# Altium schematic sheet RIGHT_AR0234.SchDoc: =project_title
size Tabloid; CompanyName: Luxonis Holding; Organization: Luxonis Holding; Address1: 1925 Harmony Park Drive; Address2: Westminster, CO; Address3: 80234; Address4: United States; SheetNumber: 10; SheetTotal: 11
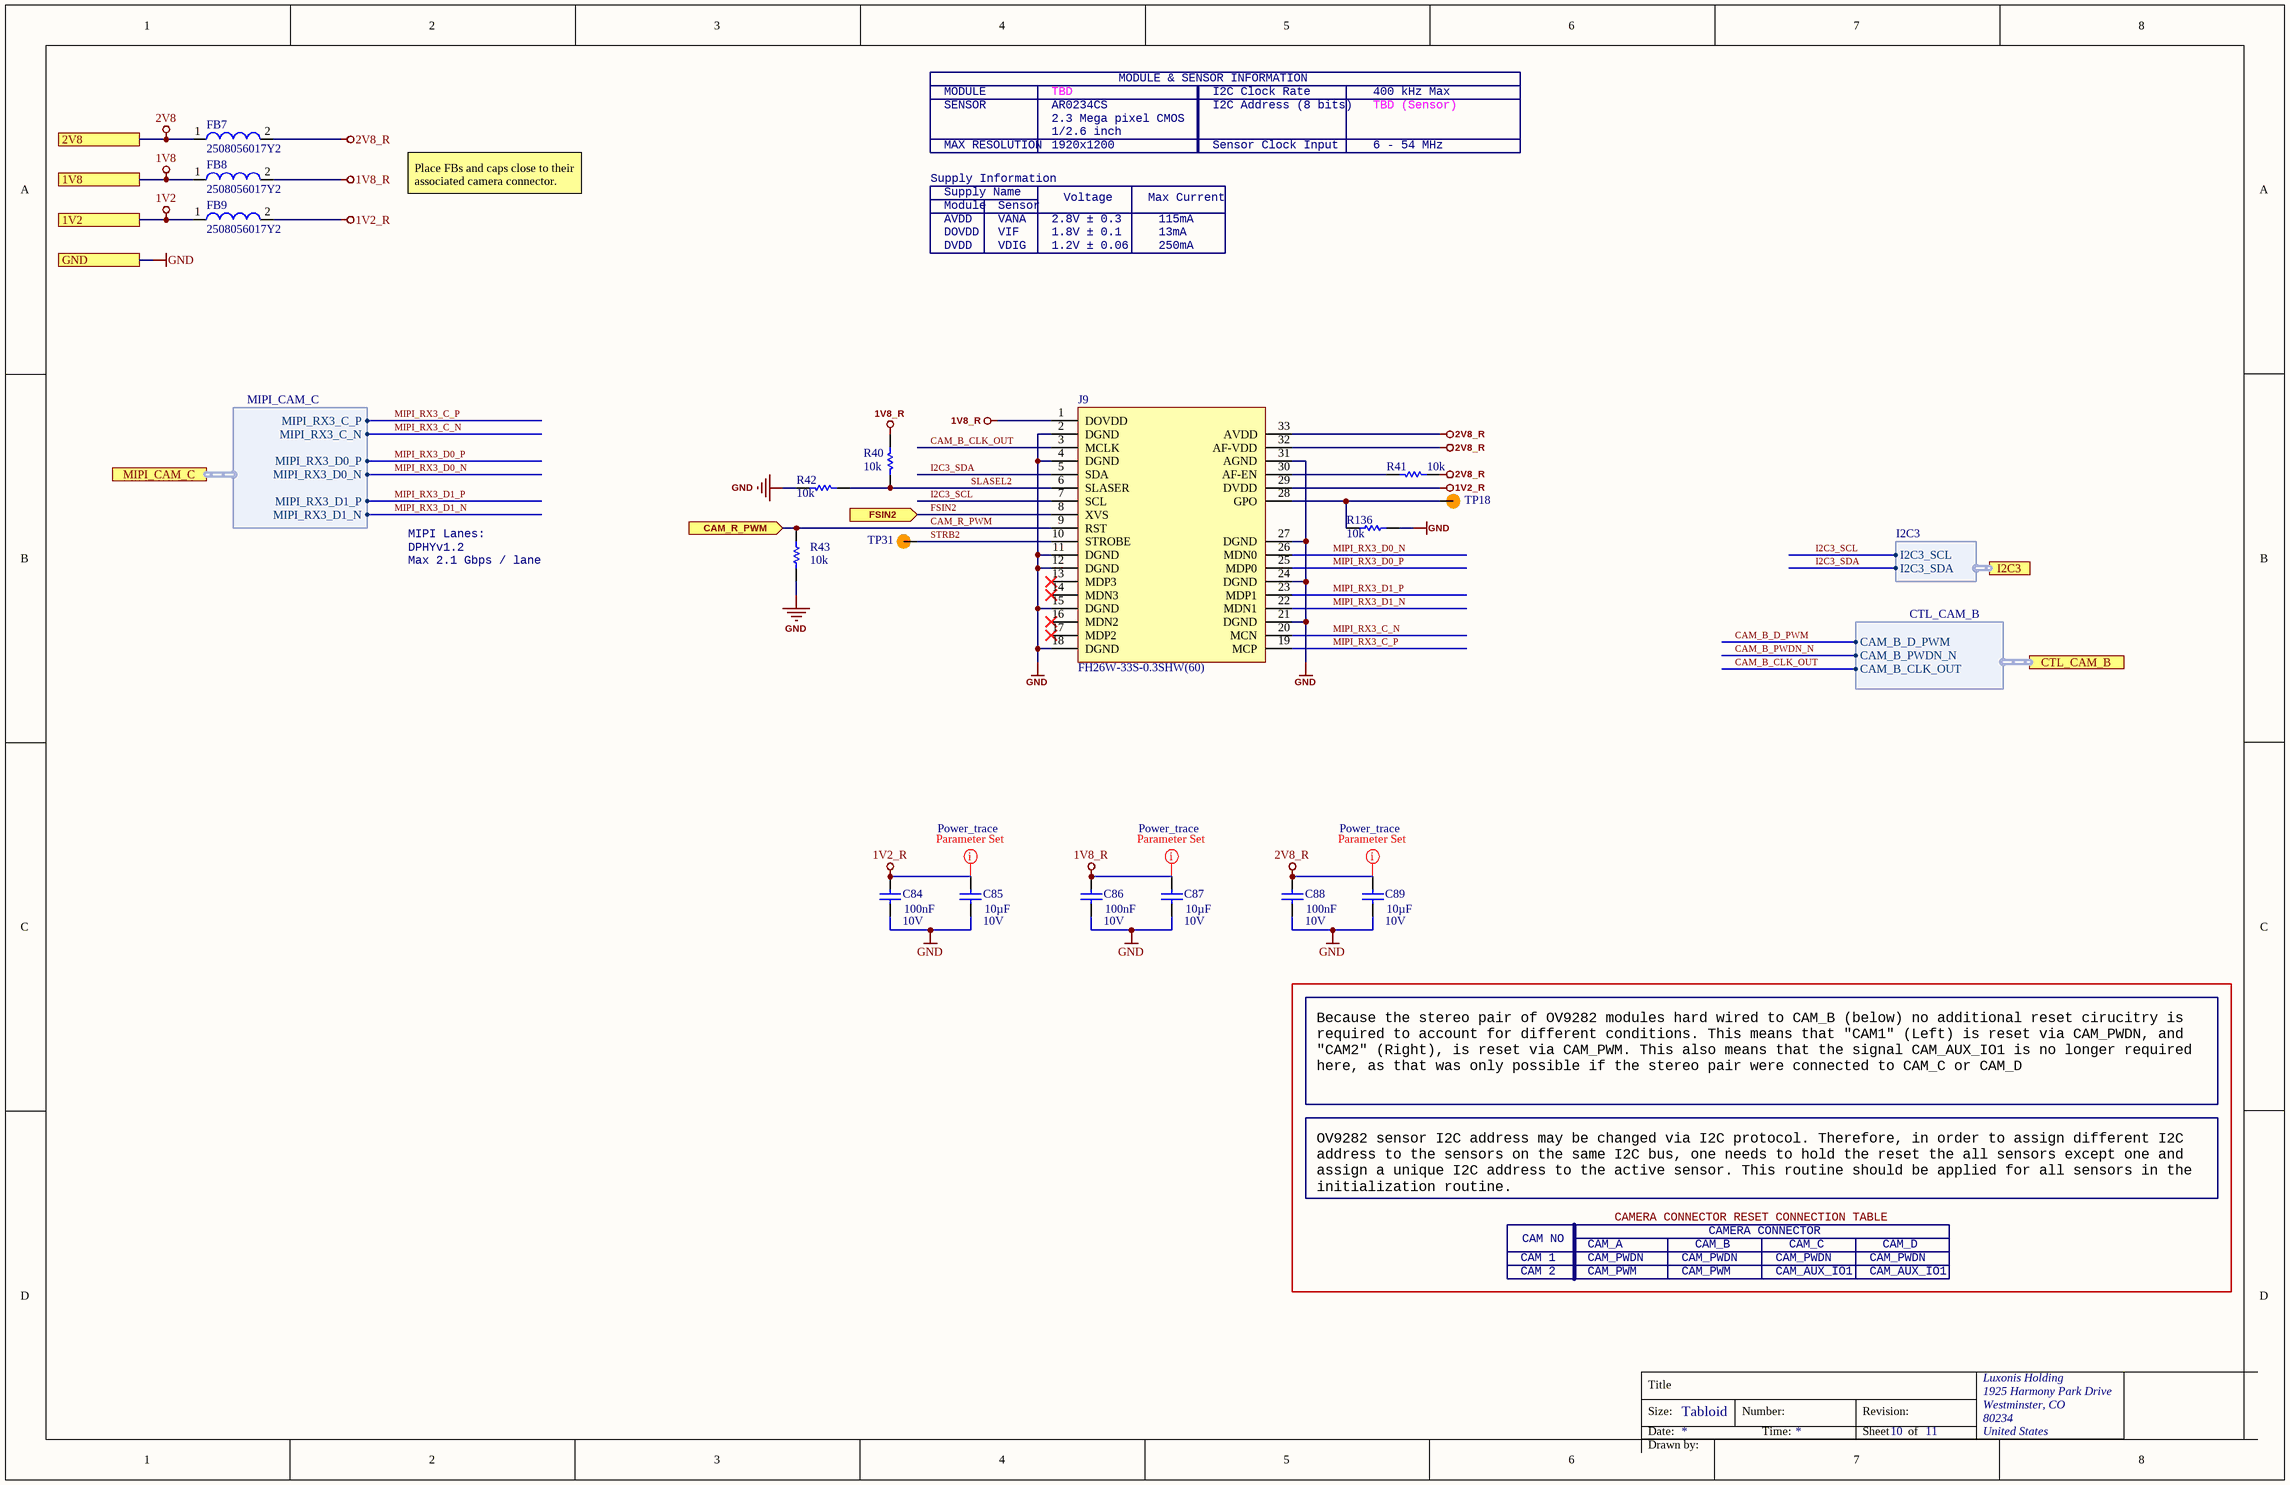
[diagram p0: RIGHT_AR0234.SchDoc]

## Parts
C84  value 100nF  Voltage Rating: 10V  [CAPC0402(1005)70_L]  (hidden comment: GRM155R71A104JA01D)
C85  value 10µF  Voltage Rating: 10V  [CAPC0603(1608)100_L]  (hidden comment: GRM188R61A106ME69D)
C86  value 100nF  Voltage Rating: 10V  [CAPC0402(1005)70_L]  (hidden comment: GRM155R71A104JA01D)
C87  value 10µF  Voltage Rating: 10V  [CAPC0603(1608)100_L]  (hidden comment: GRM188R61A106ME69D)
C88  value 100nF  Voltage Rating: 10V  [CAPC0402(1005)70_L]  (hidden comment: GRM155R71A104JA01D)
C89  value 10µF  Voltage Rating: 10V  [CAPC0603(1608)100_L]  (hidden comment: GRM188R61A106ME69D)
FB7  2508056017Y2  [2508056017Y2]
FB8  2508056017Y2  [2508056017Y2]
FB9  2508056017Y2  [2508056017Y2]
J9  FH26W-33S-0.3SHW(60)  [FH26W-33S-0.3SHW(60)]
R40  value 10k  [RESC0402(1005)_L]  (hidden comment: RC0402FR-1310KL)
R41  value 10k  [RESC0402(1005)_L]  (hidden comment: RC0402FR-1310KL)
R42  value 10k  [RESC0402(1005)_L]  (hidden comment: RC0402FR-1310KL)
R43  value 10k  [RESC0402(1005)_L]  (hidden comment: RC0402FR-1310KL)
R136  value 10k  [RESC0402(1005)_L]  (hidden comment: RC0402FR-1310KL)
TP18  TEST_POINT  [TP100_200_NS]  (value not drawn)  (no BOM)
TP31  TEST_POINT  [TP100_200_NS]  (value not drawn)  (no BOM)

## Ports
1V2, 1V8, 2V8, CAM_R_PWM (in), CTL_CAM_B (harness CTL_CAM_B), FSIN2 (in), GND, I2C3 (harness I2C3), MIPI_CAM_C (harness MIPI_CAM_C)

## Harnesses
MIPI_CAM_C: MIPI_RX3_C_P, MIPI_RX3_C_N, MIPI_RX3_D0_P, MIPI_RX3_D0_N, MIPI_RX3_D1_P, MIPI_RX3_D1_N
I2C3: I2C3_SDA, I2C3_SCL
CTL_CAM_B: CAM_B_CLK_OUT, CAM_B_PWDN_N, CAM_B_D_PWM

## Nets
1V2: FB9.1 ; port 1V2
1V2_R: C84.2 C85.2 FB9.2 J9.29(DVDD)
1V8: FB8.1 ; port 1V8
1V8_R: C86.2 C87.2 FB8.2 J9.1(DOVDD) R40.1
2V8: FB7.1 ; port 2V8
2V8_R: C88.2 C89.2 FB7.2 J9.32(AF-VDD) J9.33(AVDD) R41.2
GND: C84.1 C85.1 C86.1 C87.1 C88.1 C89.1 J9.2(DGND) J9.4(DGND) J9.11(DGND) J9.12(DGND) J9.15(DGND) J9.18(DGND) J9.21(DGND) J9.24(DGND) J9.27(DGND) J9.31(AGND) R42.1 R43.1 R136.2 ; port GND
CAM_B_CLK_OUT: J9.3(MCLK) ; port CTL_CAM_B.CAM_B_CLK_OUT
CAM_B_D_PWM: port CTL_CAM_B.CAM_B_D_PWM
CAM_B_PWDN_N: port CTL_CAM_B.CAM_B_PWDN_N
CAM_R_PWM: J9.9(RST) R43.2 ; port CAM_R_PWM
FSIN2: J9.8(XVS) ; port FSIN2
I2C3_SCL: J9.7(SCL) ; port I2C3.I2C3_SCL
I2C3_SDA: J9.5(SDA) ; port I2C3.I2C3_SDA
MIPI_RX3_C_N: J9.20(MCN) ; port MIPI_CAM_C.MIPI_RX3_C_N
MIPI_RX3_C_P: J9.19(MCP) ; port MIPI_CAM_C.MIPI_RX3_C_P
MIPI_RX3_D0_N: J9.26(MDN0) ; port MIPI_CAM_C.MIPI_RX3_D0_N
MIPI_RX3_D0_P: J9.25(MDP0) ; port MIPI_CAM_C.MIPI_RX3_D0_P
MIPI_RX3_D1_N: J9.22(MDN1) ; port MIPI_CAM_C.MIPI_RX3_D1_N
MIPI_RX3_D1_P: J9.23(MDP1) ; port MIPI_CAM_C.MIPI_RX3_D1_P
SLASEL2: J9.6(SLASER) R40.2 R42.2
STRB2: J9.10(STROBE) TP31.1
NetJ9_28: J9.28(GPO) R136.1 TP18.1
NetJ9_30: J9.30(AF-EN) R41.1

Not connected (* = marked no-connect by the designer): J9 13(MDP3)* 14(MDN3)* 16(MDN2)* 17(MDP2)*

## Layout directives
net class Power_trace: 1V2_R, 1V8_R, 2V8_R

## Notes on the sheet
- MODULE
- TBD
- MODULE & SENSOR INFORMATION
- I2C Clock Rate
- 400 kHz Max
- SENSOR
- MAX RESOLUTION
- 2.3 Mega pixel CMOS
- 1920x1200
- AR0234CS
- 1/2.6 inch
- I2C Address (8 bits)
- Sensor Clock Input
- TBD (Sensor)
- 6 - 54 MHz
- Place FBs and caps close to their associated camera connector.
- Supply Information
- AVDD
- Supply Name
- Module
- VANA
- Sensor
- 2.8V ± 0.3
- Voltage
- Max Current
- 115mA
- DOVDD
- DVDD
- VIF
- VDIG
- 1.8V ± 0.1
- 1.2V ± 0.06
- 13mA
- 250mA
- MIPI Lanes:
- Max 2.1 Gbps / lane
- DPHYv1.2
- Because the stereo pair of OV9282 modules hard wired to CAM_B (below) no additional reset cirucitry is required to account for different conditions. This means that "CAM1" (Left) is reset via CAM_PWDN, and "CAM2" (Right), is reset via CAM_PWM. This also means that the signal CAM_AUX_IO1 is no longer required here, as that was only possible if the stereo pair were connected to CAM_C or CAM_D
- OV9282 sensor I2C address may be changed via I2C protocol. Therefore, in order to assign different I2C address to the sensors on the same I2C bus, one needs to hold the reset the all sensors except one and assign a unique I2C address to the active sensor. This routine should be applied for all sensors in the initialization routine.
- CAMERA CONNECTOR RESET CONNECTION TABLE
- CAMERA CONNECTOR
- CAM 1
- CAM 2
- CAM NO
- CAM_A
- CAM_PWDN
- CAM_PWM
- CAM_B
- CAM_AUX_IO1
- CAM_C
- CAM_D
- Title
- Size:
- Date:
- Tabloid
- Number:
- Time:
- Revision:
- Sheet
- of
- Drawn by:

## Library data of the parts
C84 C86 C88 = CMP-108-000015-5: CAP CER 0.1UF 10V X7R 0402 5%; Manufacturer 1: Murata; Manufacturer Part Number 1: GRM155R71A104JA01D; Case/Package: 0402; Min Operating Temperature: -55°C; Max Operating Temperature: 125°C; Tolerance: 5%; Dielectric: X7R; Length: 1mm; Height: 0.5mm; Width: 0.02inch; Depth: 0.5mm; ComponentLink1URL: https://datasheet.ciiva.com/5411/product-5411135.pdf?src-supplier=Mouser; ComponentLink1Description: https://datasheet.ciiva.com/5411/product-5411135.pdf?src-supplier=Mouser; ComponentLink2URL: https://datasheet.ciiva.com/11618/c02e-11618821.pdf?src-supplier=Avnet; ComponentLink2Description: https://datasheet.ciiva.com/11618/c02e-11618821.pdf?src-supplier=Avnet; Design Item ID: GRM155R71A104JA01D; Mounting Technology: SMT
C85 C87 C89 = CMP-004-000018-4: CAP CER 10UF 10V X5R 0603 20%; Manufacturer 1: Murata; Manufacturer Part Number 1: GRM188R61A106ME69D; Case/Package: 0603; Min Operating Temperature: -55°C; Max Operating Temperature: 85°C; Tolerance: 20%; Dielectric: X5R; Length: 1.6mm; Height: 0.8mm; Width: 0.8mm; Depth: 0.8mm; ComponentLink1URL: http://www.mouser.com/ds/2/281/c02e-2905.pdf?src-supplier=Mouser; ComponentLink1Description: http://www.mouser.com/ds/2/281/c02e-2905.pdf?src-supplier=Mouser; ComponentLink2URL: http://components.arrow.com/part/dataview/0323_06119472?src-supplier=Arrow+Europe; ComponentLink2Description: http://components.arrow.com/part/dataview/0323_06119472?src-supplier=Arrow+Europe; ComponentLink3URL: http://www.farnell.com/datasheets/2048014.pdf?src-supplier=Farnell; ComponentLink3Description: http://www.farnell.com/datasheets/2048014.pdf?src-supplier=Farnell; ComponentLink4URL: http://www.farnell.com/datasheets/1872210.pdf?src-supplier=Farnell; ComponentLink4Description: http://www.farnell.com/datasheets/1872210.pdf?src-supplier=Farnell; ComponentLink5URL: http://search.murata.co.jp/Ceramy/image/img/A01X/G101/ENG/GRM188R61A106ME69-01.pdf?src-supplier=Digi-Key; ComponentLink5Description: http://search.murata.co.jp/Ceramy/image/img/A01X/G101/ENG/GRM188R61A106ME69-01.pdf?src-supplier=Digi-Key; ComponentLink6URL: http://www.farnell.com/datasheets/1872210.pdf?src-supplier=Newark; ComponentLink6Description: http://www.farnell.com/datasheets/1872210.pdf?src-supplier=Newark; ComponentLink7URL: http://www.farnell.com/datasheets/2048014.pdf?src-supplier=Element14; ComponentLink7Description: http://www.farnell.com/datasheets/2048014.pdf?src-supplier=Element14; ComponentLink8URL: http://www.farnell.com/datasheets/2048014.pdf?src-supplier=Newark; ComponentLink8Description: http://www.farnell.com/datasheets/2048014.pdf?src-supplier=Newark; Design Item ID: GRM188R61A106ME69D; Mounting Technology: SMT
FB7-FB9 = CMP-082-000000-2: FERRITE BEAD, 0.1OHM, 2A, 0805, 600R/100MHz; Manufacturer 1: Fair-Rite; Tolerance: 25%; Manufacturer Part Number 1: 2508056017Y2; Case/Package: 0805; Current Rating: 2A
J9 = CMP-002-00090-3: FFC/FPC Connector, 33 Contact(s), 1 Row(s), Female, Right Angle, Surface Mount Terminal; Manufacturer 1: Hirose; Manufacturer Part Number 1: FH26W-33S-0.3SHW(60); RoHS: Yes; Category: FFC / FPC; Stock 1: 627; Pricing 1: 1=1,78000, 10=1,61700, 25=1,51800, 50=1,45200, 100=1,38600, 250=1,25400, 500=1,15500, 1000=0,99000, 2500=0,92400 (USD); ComponentLink1URL: https://datasheet.ciiva.com:443/pdfs/VipMasterIC/IC/HIRO/HIRO-S-A0007913874/HIRO-S-A0008593114-1.pdf?src-supplier=IHS+Markit; ComponentLink1Description: https://datasheet.ciiva.com:443/pdfs/VipMasterIC/IC/HIRO/HIRO-S-A0007913874/HIRO-S-A0008593114-1.pdf?src-supplier=IHS+Markit; ComponentLink2URL: https://www.hirose.com/product/en/download_file/key_name/FH26/category/Catalog/doc_file_id/49355/?file_category_id=4&item_id=298&is_series=1&src-supplier=Digi-Key; ComponentLink2Description: https://www.hirose.com/product/en/download_file/key_name/FH26/category/Catalog/doc_file_id/49355/?file_category_id=4&item_id=298&is_series=1&src-supplier=Digi-Key; ComponentLink3URL: https://www.hirose.com/product/download/?distributor=digikey&amp;type=2d&amp;lang=en&amp;num=FH26W-13S-0.3SHW(60)&src-supplier=Digi-Key; ComponentLink3Description: https://www.hirose.com/product/download/?distributor=digikey&amp;type=2d&amp;lang=en&amp;num=FH26W-13S-0.3SHW(60)&src-supplier=Digi-Key; Design Item ID: FH26W-33S-0.3SHW(60); Pins: 33; Source: LuxonisMaster.SchLib
R40-R43 R136 = CMP-115-000004-8: RES SMD 10K OHM 1% 1/16W 0402; Manufacturer 1: Yageo; Temperature Coefficient: 100ppm/°C; Power Rating: 62.5mW; Voltage Rating: 50V; Manufacturer Part Number 1: RC0402FR-1310KL; Case/Package: 0402; Min Operating Temperature: -55°C; Max Operating Temperature: 155°C; Tolerance: 1%; Design Item ID: RC0402FR-1310KL
TP18 TP31 = CMP-015-000000-2: Manufacturer Part Number 1: /; Design Item ID: TEST_POINT; Source: LuxonisMaster.SchLib